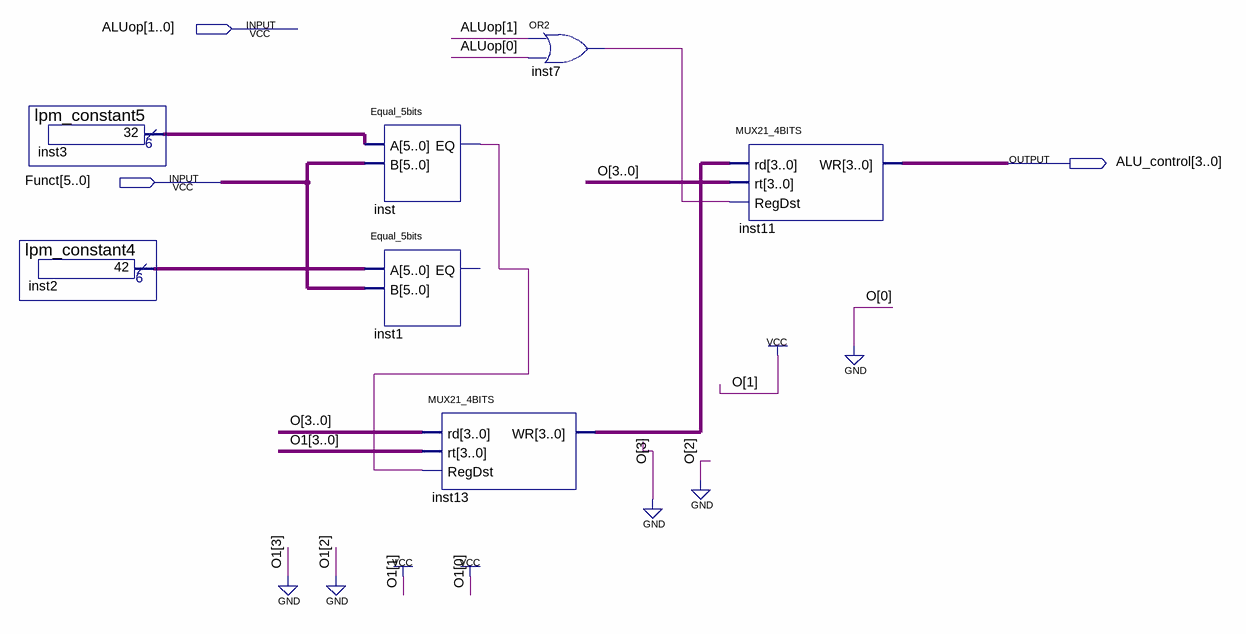
[diagram p0: schematic sheet]
// Quartus schematic ALU_Control.bdf as structural Verilog: 7 symbols, 3 pins
module ALU_Control (
  input  [1:0] ALUop,
  input  [5:0] Funct,
  output [3:0] ALU_control
);

  wire inst7_out, inst_eq;
  wire [3:0] inst13_wr;
  wire [5:0] inst2_result, inst3_result;

  lpm_constant5 inst3 (.result(inst3_result));
  lpm_constant4 inst2 (.result(inst2_result));
  Equal_5bits inst (.A(inst3_result), .B(Funct), .EQ(inst_eq));
  Equal_5bits inst1 (.A(inst2_result), .B(Funct));  // open: EQ
  MUX21_4BITS inst13 (.rd(4'b0010), .rt(4'b0011), .RegDst(inst_eq), .WR(inst13_wr));
  or inst7 (inst7_out, ALUop[1], ALUop[0]);
  MUX21_4BITS inst11 (.rd(inst13_wr), .rt(4'b0010), .RegDst(inst7_out), .WR(ALU_control));
endmodule
